# EAGLE schematic untitled (EAGLE 9.6.1)
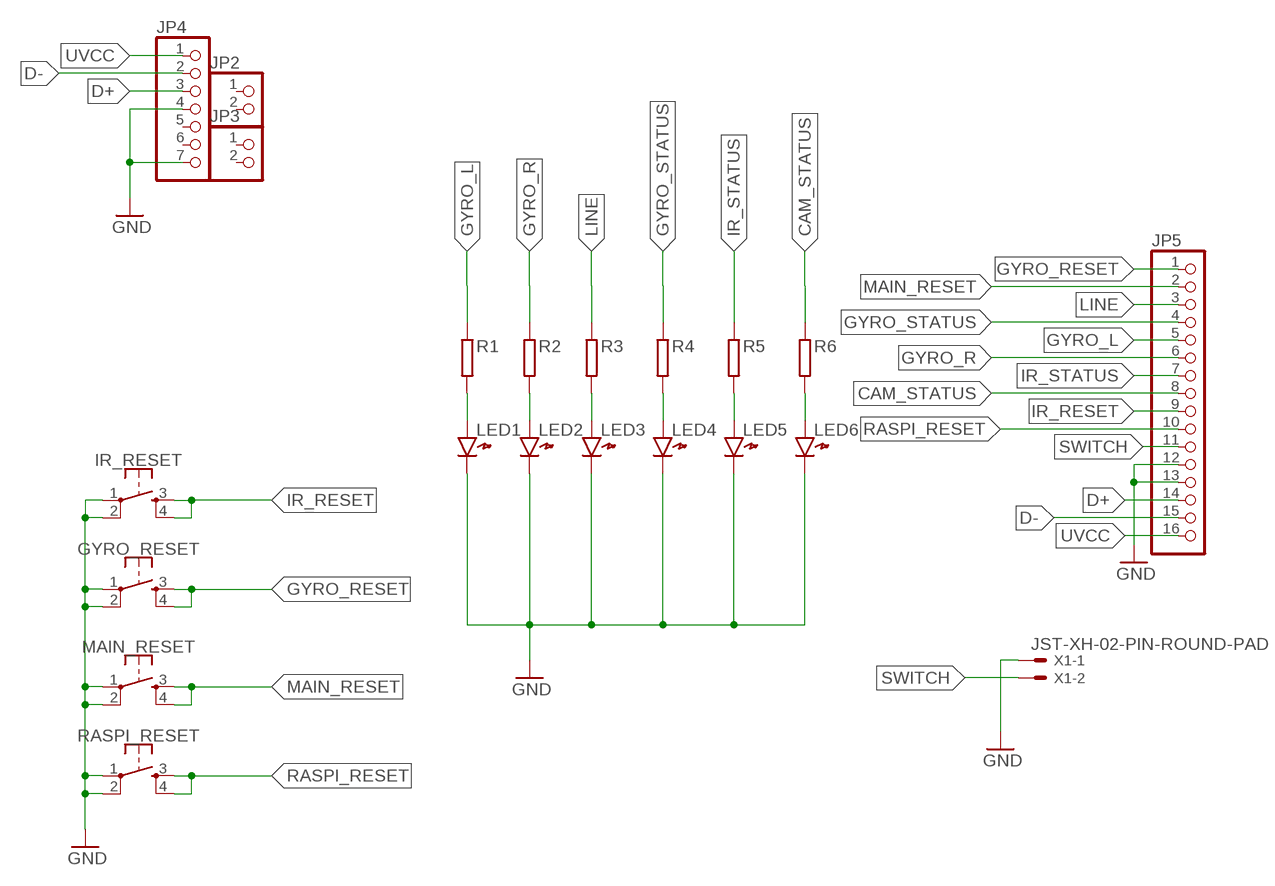
[diagram p0: schematic, sheet 1]

## Parts
GYRO_RESET  MOMENTARY-SWITCH-SPST-2-SMD-5.2MM  [TACTILE_SWITCH_SMD_5.2MM]
IR_RESET  MOMENTARY-SWITCH-SPST-2-SMD-5.2MM  [TACTILE_SWITCH_SMD_5.2MM]
JP2  PINHD-1X2  [1X02]
JP3  PINHD-1X2  [1X02]
JP4  PINHD-1X7  [1X07]
JP5  PINHD-1X16  [1X16]
LED1  LED1608  [LED1608]
LED2  LED1608  [LED1608]
LED3  LED1608  [LED1608]
LED4  LED1608  [LED1608]
LED5  LED1608  [LED1608]
LED6  LED1608  [LED1608]
MAIN_RESET  MOMENTARY-SWITCH-SPST-2-SMD-5.2MM  [TACTILE_SWITCH_SMD_5.2MM]
R1  RESISTOR1608  [SMD1608]
R2  RESISTOR1608  [SMD1608]
R3  RESISTOR1608  [SMD1608]
R4  RESISTOR1608  [SMD1608]
R5  RESISTOR1608  [SMD1608]
R6  RESISTOR1608  [SMD1608]
RASPI_RESET  MOMENTARY-SWITCH-SPST-2-SMD-5.2MM  [TACTILE_SWITCH_SMD_5.2MM]
X1  JST-XH-02-PIN-ROUND-PAD  [JST-XH-02-PACKAGE-ROUND-PAD]

## Nets
CAM_STATUS: JP5.8 R6.1
D+: JP4.3 JP5.14
D-: JP4.2 JP5.15
GND: GYRO_RESET.1 GYRO_RESET.2 IR_RESET.1 IR_RESET.2 JP4.4 JP4.7 JP5.12 JP5.13 LED1.K LED2.K LED3.K LED4.K LED5.K LED6.K MAIN_RESET.1 MAIN_RESET.2 RASPI_RESET.1 RASPI_RESET.2 X1.1
GYRO_L: JP5.5 R1.1
GYRO_R: JP5.6 R2.1
GYRO_RESET: GYRO_RESET.3 GYRO_RESET.4 JP5.1
GYRO_STATUS: JP5.4 R4.1
IR_RESET: IR_RESET.3 IR_RESET.4 JP5.9
IR_STATUS: JP5.7 R5.1
LINE: JP5.3 R3.1
MAIN_RESET: JP5.2 MAIN_RESET.3 MAIN_RESET.4
N$1: LED1.A R1.2
N$2: LED2.A R2.2
N$3: LED3.A R3.2
N$4: LED4.A R4.2
N$5: LED5.A R5.2
N$6: LED6.A R6.2
RASPI_RESET: JP5.10 RASPI_RESET.3 RASPI_RESET.4
SWITCH: JP5.11 X1.2
UVCC: JP4.1 JP5.16
Unconnected: JP2.1 JP2.2 JP3.1 JP3.2 JP4.5 JP4.6

## Library data of the parts
GYRO_RESET IR_RESET MAIN_RESET RASPI_RESET = SparkFun-Switches:MOMENTARY-SWITCH-SPST-2: Momentary Switch (Pushbutton) - SPST - Two Circuits Normally-open (NO) SPST momentary switches (buttons, pushbuttons). Schematic symbol includes two switch circuits. Variants SMD-4.6MMX2.8MM - 4.60mm x 2.80mm Tactile Momentary Button Switch - Used on SparkFun Pro Micro - RP2040 <https://www.sparkfun.com/products/17717> SMD-5.2MM - Mini Pushbutton Switch - SMD <https://www.sparkfun.com/products/8720> - Used on Arduino Pro Mini <https://www.sparkfun.com/products/11114>; PROD_ID: SWCH-08247; SF_SKU: COM-08720
JP2 JP3 = pinhead:PINHD-1X2: PIN HEADER
JP4 = pinhead:PINHD-1X7: PIN HEADER
JP5 = pinhead:PINHD-1X16: PIN HEADER
LED1-LED6 = generic:LED: Generic LEDs
R1-R6 = generic:RESISTOR: Generic Registor
X1 = Rembrandt Electronics - JST XH Connectors v1-0:JST-XH-02-PIN: JST XH Connector 2 Pin Wire to board connector. Pitch: 2,54 mm, (0.100") Number of pins: 2 Created by Rembrandt Electronics www.rembrandtelectronics.com